# Altium schematic sheet Stepper Motor Driver Board.SchDoc
size A; SheetNumber: 1; SheetTotal: 5
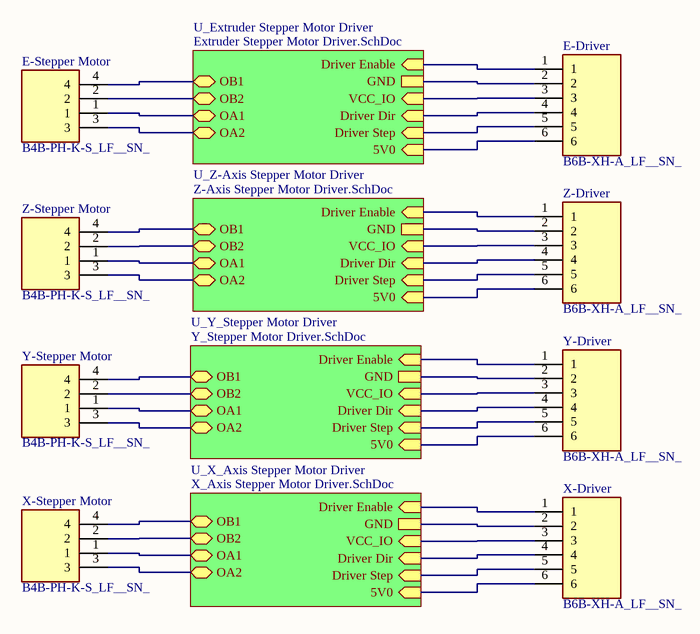
[diagram p0: Stepper Motor Driver Board.SchDoc]

## Parts
E-Driver  B6B-XH-A_LF__SN_  [SHDR6W64P0X250_1X6_1740X575X700P]
E-Stepper_Motor  B4B-PH-K-S_LF__SN_  [SHDR4W50P0X200_1X4_990X450X600P]
X-Driver  B6B-XH-A_LF__SN_  [SHDR6W64P0X250_1X6_1740X575X700P]
X-Stepper_Motor  B4B-PH-K-S_LF__SN_  [SHDR4W50P0X200_1X4_990X450X600P]
Y-Driver  B6B-XH-A_LF__SN_  [SHDR6W64P0X250_1X6_1740X575X700P]
Y-Stepper_Motor  B4B-PH-K-S_LF__SN_  [SHDR4W50P0X200_1X4_990X450X600P]
Z-Driver  B6B-XH-A_LF__SN_  [SHDR6W64P0X250_1X6_1740X575X700P]
Z-Stepper_Motor  B4B-PH-K-S_LF__SN_  [SHDR4W50P0X200_1X4_990X450X600P]

## Sub-sheets
U_Extruder Stepper Motor Driver = Extruder Stepper Motor Driver.SchDoc: Driver Dir (in), Driver Step (in), Driver Enable (in), 5V0 (in), OB1 (bidir), OB2 (bidir), OA1 (bidir), OA2 (bidir), VCC_IO (in), GND
U_X_Axis Stepper Motor Driver = X_Axis Stepper Motor Driver.SchDoc: Driver Dir (in), Driver Step (in), Driver Enable (in), 5V0 (in), OB1 (bidir), OB2 (bidir), OA1 (bidir), OA2 (bidir), VCC_IO (in), GND
U_Y_Stepper Motor Driver = Y_Stepper Motor Driver.SchDoc: Driver Dir (in), Driver Step (in), Driver Enable (in), 5V0 (in), OB1 (bidir), OB2 (bidir), OA1 (bidir), OA2 (bidir), VCC_IO (in), GND
U_Z-Axis Stepper Motor Driver = Z-Axis Stepper Motor Driver.SchDoc: Driver Dir (in), Driver Step (in), Driver Enable (in), 5V0 (in), OB1 (bidir), OB2 (bidir), OA1 (bidir), OA2 (bidir), VCC_IO (in), GND

## Nets
NetE-Driver_1: E-Driver.1 ; sheet U_Extruder Stepper Motor Driver/Driver Enable
NetE-Driver_2: E-Driver.2 ; sheet U_Extruder Stepper Motor Driver/GND
NetE-Driver_3: E-Driver.3 ; sheet U_Extruder Stepper Motor Driver/VCC_IO
NetE-Driver_4: E-Driver.4 ; sheet U_Extruder Stepper Motor Driver/Driver Dir
NetE-Driver_5: E-Driver.5 ; sheet U_Extruder Stepper Motor Driver/Driver Step
NetE-Driver_6: E-Driver.6 ; sheet U_Extruder Stepper Motor Driver/5V0
NetE-Stepper_Motor_1: E-Stepper_Motor.1 ; sheet U_Extruder Stepper Motor Driver/OA1
NetE-Stepper_Motor_2: E-Stepper_Motor.2 ; sheet U_Extruder Stepper Motor Driver/OB2
NetE-Stepper_Motor_3: E-Stepper_Motor.3 ; sheet U_Extruder Stepper Motor Driver/OA2
NetE-Stepper_Motor_4: E-Stepper_Motor.4 ; sheet U_Extruder Stepper Motor Driver/OB1
NetX-Driver_1: X-Driver.1 ; sheet U_X_Axis Stepper Motor Driver/Driver Enable
NetX-Driver_2: X-Driver.2 ; sheet U_X_Axis Stepper Motor Driver/GND
NetX-Driver_3: X-Driver.3 ; sheet U_X_Axis Stepper Motor Driver/VCC_IO
NetX-Driver_4: X-Driver.4 ; sheet U_X_Axis Stepper Motor Driver/Driver Dir
NetX-Driver_5: X-Driver.5 ; sheet U_X_Axis Stepper Motor Driver/Driver Step
NetX-Driver_6: X-Driver.6 ; sheet U_X_Axis Stepper Motor Driver/5V0
NetX-Stepper_Motor_1: X-Stepper_Motor.1 ; sheet U_X_Axis Stepper Motor Driver/OA1
NetX-Stepper_Motor_2: X-Stepper_Motor.2 ; sheet U_X_Axis Stepper Motor Driver/OB2
NetX-Stepper_Motor_3: X-Stepper_Motor.3 ; sheet U_X_Axis Stepper Motor Driver/OA2
NetX-Stepper_Motor_4: X-Stepper_Motor.4 ; sheet U_X_Axis Stepper Motor Driver/OB1
NetY-Driver_1: Y-Driver.1 ; sheet U_Y_Stepper Motor Driver/Driver Enable
NetY-Driver_2: Y-Driver.2 ; sheet U_Y_Stepper Motor Driver/GND
NetY-Driver_3: Y-Driver.3 ; sheet U_Y_Stepper Motor Driver/VCC_IO
NetY-Driver_4: Y-Driver.4 ; sheet U_Y_Stepper Motor Driver/Driver Dir
NetY-Driver_5: Y-Driver.5 ; sheet U_Y_Stepper Motor Driver/Driver Step
NetY-Driver_6: Y-Driver.6 ; sheet U_Y_Stepper Motor Driver/5V0
NetY-Stepper_Motor_1: Y-Stepper_Motor.1 ; sheet U_Y_Stepper Motor Driver/OA1
NetY-Stepper_Motor_2: Y-Stepper_Motor.2 ; sheet U_Y_Stepper Motor Driver/OB2
NetY-Stepper_Motor_3: Y-Stepper_Motor.3 ; sheet U_Y_Stepper Motor Driver/OA2
NetY-Stepper_Motor_4: Y-Stepper_Motor.4 ; sheet U_Y_Stepper Motor Driver/OB1
NetZ-Driver_1: Z-Driver.1 ; sheet U_Z-Axis Stepper Motor Driver/Driver Enable
NetZ-Driver_2: Z-Driver.2 ; sheet U_Z-Axis Stepper Motor Driver/GND
NetZ-Driver_3: Z-Driver.3 ; sheet U_Z-Axis Stepper Motor Driver/VCC_IO
NetZ-Driver_4: Z-Driver.4 ; sheet U_Z-Axis Stepper Motor Driver/Driver Dir
NetZ-Driver_5: Z-Driver.5 ; sheet U_Z-Axis Stepper Motor Driver/Driver Step
NetZ-Driver_6: Z-Driver.6 ; sheet U_Z-Axis Stepper Motor Driver/5V0
NetZ-Stepper_Motor_1: Z-Stepper_Motor.1 ; sheet U_Z-Axis Stepper Motor Driver/OA1
NetZ-Stepper_Motor_2: Z-Stepper_Motor.2 ; sheet U_Z-Axis Stepper Motor Driver/OB2
NetZ-Stepper_Motor_3: Z-Stepper_Motor.3 ; sheet U_Z-Axis Stepper Motor Driver/OA2
NetZ-Stepper_Motor_4: Z-Stepper_Motor.4 ; sheet U_Z-Axis Stepper Motor Driver/OB1

## Library data of the parts
E-Driver X-Driver Y-Driver Z-Driver = B6B-XH-A_LF__SN_: Connector; Manufacturer_Name: JST (JAPAN SOLDERLESS TERMINALS); Manufacturer_Part_Number: B6B-XH-A(LF)(SN); Datasheet Link: https://datasheet.lcsc.com/szlcsc/JST-Sales-America-B6B-XH-A-LF-SN_C144397.pdf; Height: 7mm; Arrow Part Number: B6B-XH-A(LF)(SN); Arrow Price/Stock: https://www.arrow.com/en/products/b6b-xh-a-lf-sn/jst-manufacturing?region=europe
E-Stepper_Motor X-Stepper_Motor Y-Stepper_Motor Z-Stepper_Motor = B4B-PH-K-S_LF__SN_: Connector; Manufacturer_Name: JST (JAPAN SOLDERLESS TERMINALS); Manufacturer_Part_Number: B4B-PH-K-S(LF)(SN); Datasheet Link: https://datasheet.lcsc.com/szlcsc/JST-Sales-America-B4B-PH-K-S-LF-SN_C131334.pdf; Height: 6mm; Arrow Part Number: B4B-PH-K-S(LF)(SN); Arrow Price/Stock: https://www.arrow.com/en/products/b4b-ph-k-s-lf-sn/jst-manufacturing